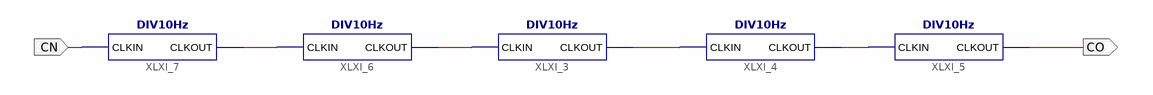
[diagram p0: schematic sheet 1]
// Xilinx ISE schematic DIV100KHz.sch (spartan6) as structural Verilog: 5 symbols, 2 ports
module DIV100KHz (
  input  CN,
  output CO
);

  wire XLXN_3, XLXN_4, XLXN_5, XLXN_6;

  DIV10Hz XLXI_7 (.CLKIN(CN), .CLKOUT(XLXN_4));
  DIV10Hz XLXI_6 (.CLKIN(XLXN_4), .CLKOUT(XLXN_5));
  DIV10Hz XLXI_3 (.CLKIN(XLXN_5), .CLKOUT(XLXN_6));
  DIV10Hz XLXI_4 (.CLKIN(XLXN_6), .CLKOUT(XLXN_3));
  DIV10Hz XLXI_5 (.CLKIN(XLXN_3), .CLKOUT(CO));
endmodule
